# EAGLE design RoDAP (EAGLE 9.4.2)
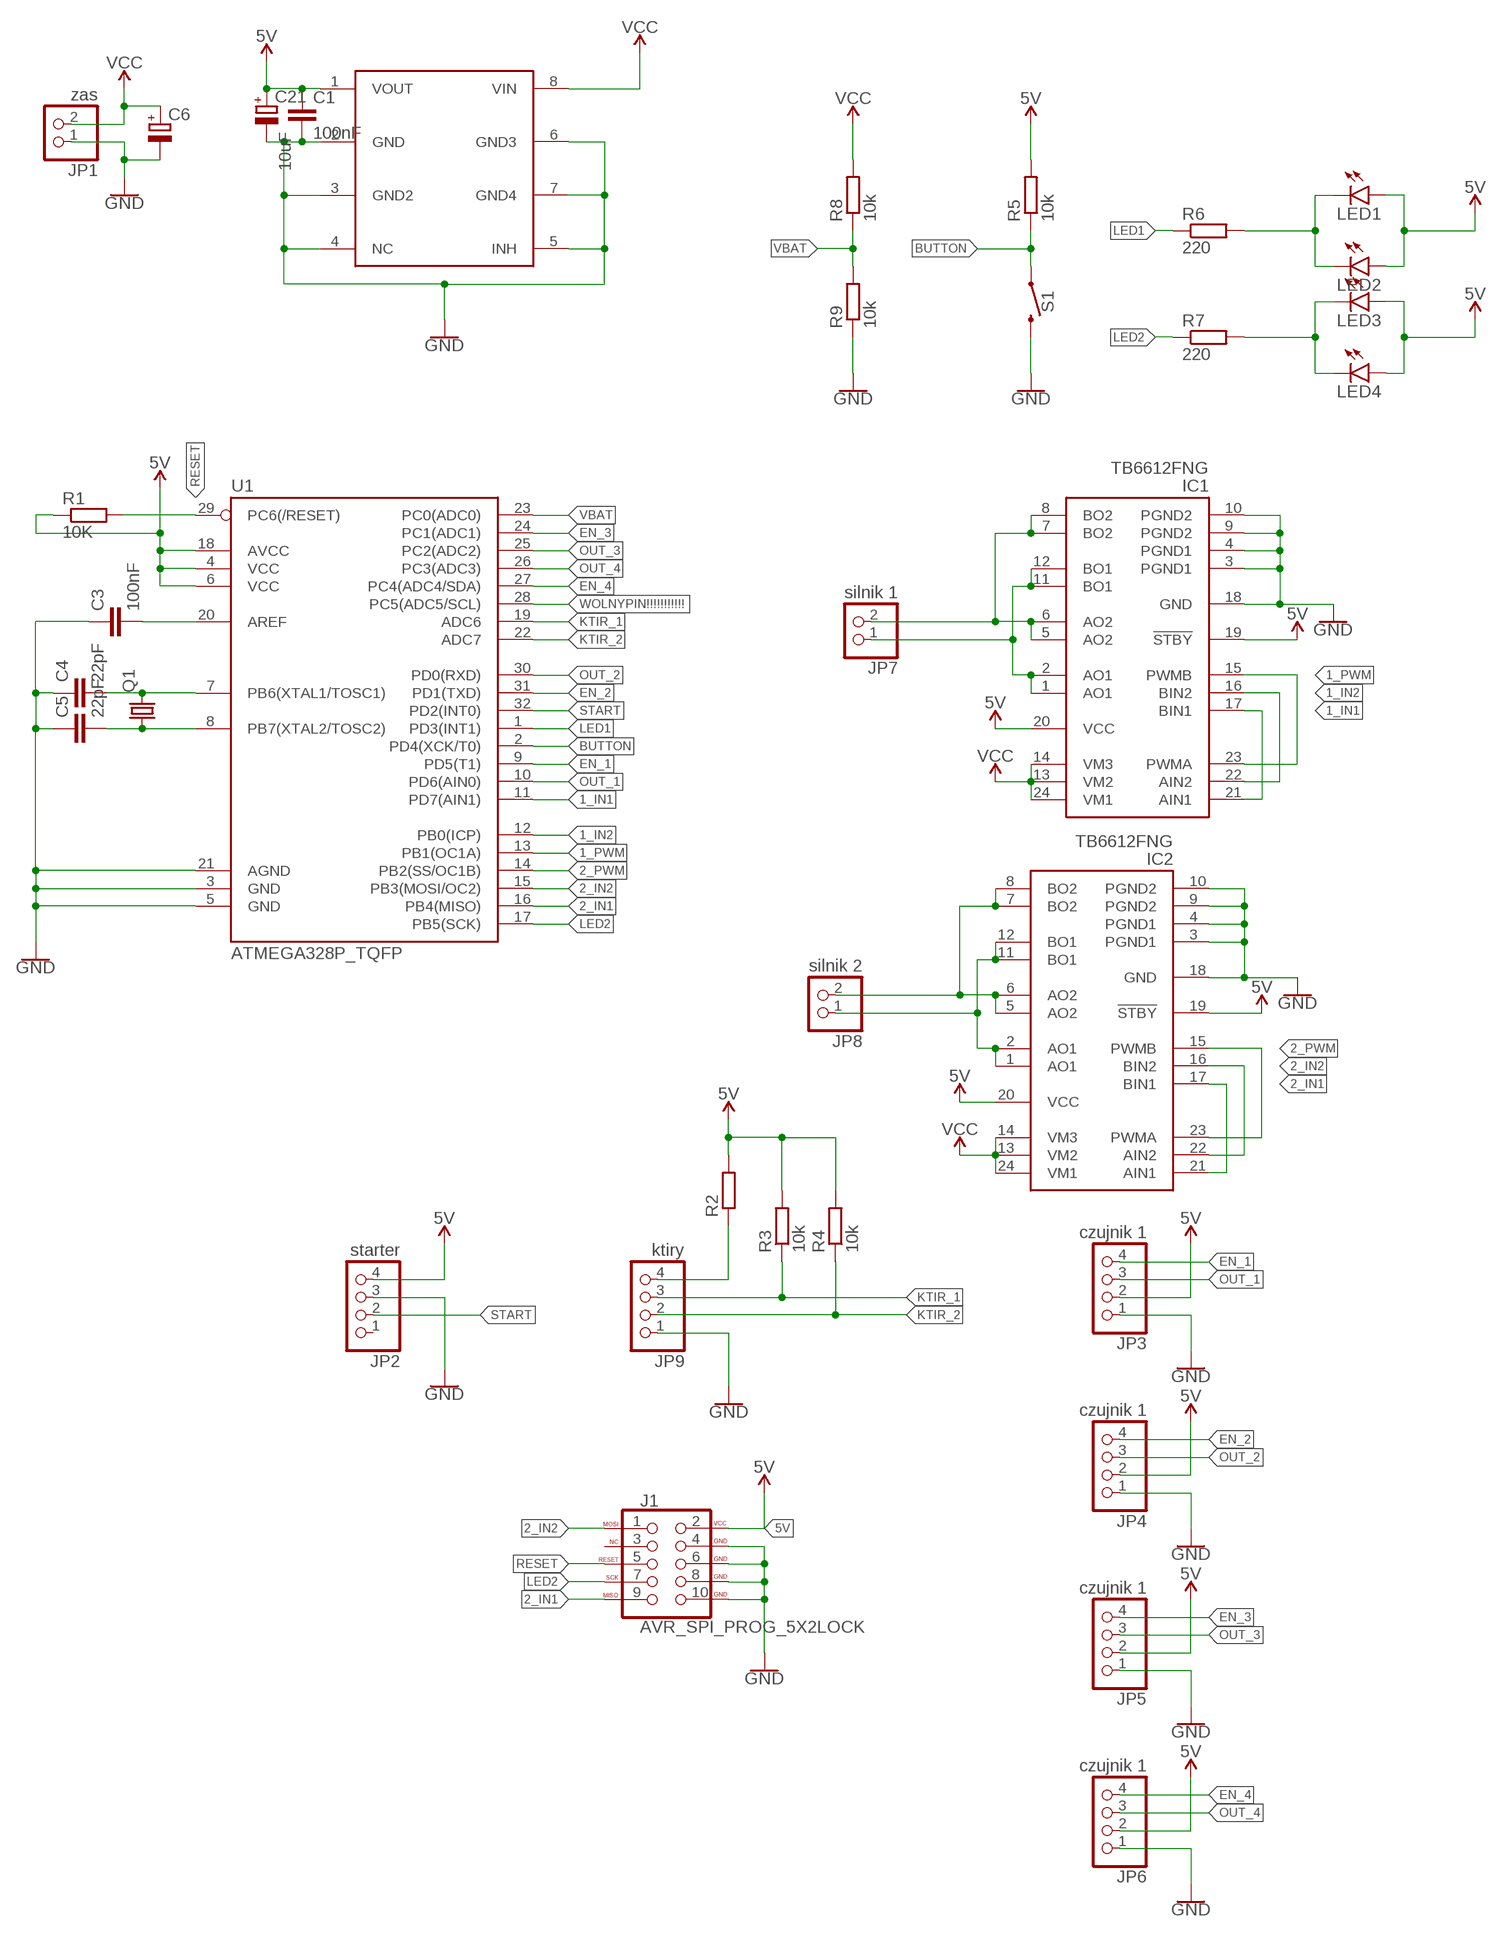
[diagram p0: schematic, sheet 1]

## Parts
C1  100nF  C-EUC0805  [C0805]
C3  100nF  C-EUC0805  [C0805]
C4  22pF  C-EUC0805  [C0805]
C5  22pF  C-EUC0805  [C0805]
C6  CPOL-EUE2.5-7  [E2,5-7]
C21  10uF  CPOL-EUSMCB  [SMC_B]
IC1  TB6612FNG  [SSOP24]
IC2  TB6612FNG  [SSOP24]
J1  AVR_SPI_PROG_5X2LOCK  [2X5-SHROUDED_LOCK]
JP1  zas  PINHD-1X2  [1X02]
JP2  starter  PINHD-1X4  [1X04]
JP3  czujnik 1  PINHD-1X4  [1X04]
JP4  czujnik 1  PINHD-1X4  [1X04]
JP5  czujnik 1  PINHD-1X4  [1X04]
JP6  czujnik 1  PINHD-1X4  [1X04]
JP7  silnik 1  PINHD-1X2  [1X02]
JP8  silnik 2  PINHD-1X2  [1X02]
JP9  ktiry  PINHD-1X4  [1X04]
LED1  LED5MM  [LED5MM]
LED2  LEDSML0805  [SML0805]
LED3  LED5MM  [LED5MM]
LED4  LEDSML0805  [SML0805]
Q1  CRYSTALHC49S  [HC49/S]
R1  10K  R-EU_R0805  [R0805]
R2  R-EU_R0805  [R0805]
R3  10k  R-EU_R0805  [R0805]
R4  10k  R-EU_R0805  [R0805]
R5  10k  R-EU_R0805  [R0805]
R6  220  R-EU_R0805  [R0805]
R7  220  R-EU_R0805  [R0805]
R8  10k  R-EU_R0805  [R0805]
R9  10k  R-EU_R0805  [R0805]
S1  MOMENTARY-SWITCH-SPST-SMD-6.0X3.5MM  [TACTILE_SWITCH_SMD_6.0X3.5MM]
U1  ATMEGA328P_TQFP  [TQFP32-08]
U$4  KF50BD-TR  [SOIC8-1.27-5X4MM]

## Nets
1_IN1: IC1.17(BIN1) IC1.21(AIN1) U1.11(PD7(AIN1))
1_IN2: IC1.16(BIN2) IC1.22(AIN2) U1.12(PB0(ICP))
1_PWM: IC1.15(PWMB) IC1.23(PWMA) U1.13(PB1(OC1A))
2_IN1: IC2.17(BIN1) IC2.21(AIN1) J1.9(MISO) U1.16(PB4(MISO))
2_IN2: IC2.16(BIN2) IC2.22(AIN2) J1.1(MOSI) U1.15(PB3(MOSI/OC2))
2_PWM: IC2.15(PWMB) IC2.23(PWMA) U1.14(PB2(SS/OC1B))
5V: C1.1 C21.+ IC1.19(!STBY) IC1.20(VCC) IC2.19(!STBY) IC2.20(VCC) J1.2(VCC) JP2.4 JP3.2 JP4.2 JP5.2 JP6.2 LED1.A LED2.A LED3.A LED4.A R1.1 R2.2 R3.2 R4.2 R5.2 U1.4(VCC) U1.6(VCC) U1.18(AVCC) U$4.1(VOUT)
BUTTON: R5.1 S1.1 U1.2(PD4(XCK/T0))
EN_1: JP3.4 U1.9(PD5(T1))
EN_2: JP4.4 U1.31(PD1(TXD))
EN_3: JP5.4 U1.24(PC1(ADC1))
EN_4: JP6.4 U1.27(PC4(ADC4/SDA))
GND: C1.2 C3.1 C4.1 C5.1 C6.- C21.- IC1.3(PGND1) IC1.4(PGND1) IC1.9(PGND2) IC1.10(PGND2) IC1.18(GND) IC2.3(PGND1) IC2.4(PGND1) IC2.9(PGND2) IC2.10(PGND2) IC2.18(GND) J1.4(GND) J1.6(GND) J1.8(GND) J1.10(GND) JP1.1 JP2.3 JP3.1 JP4.1 JP5.1 JP6.1 JP9.1 R9.1 S1.2 U1.3(GND) U1.5(GND) U1.21(AGND) U$4.2(GND) U$4.3(GND2) U$4.4(NC) U$4.5(INH) U$4.6(GND3) U$4.7(GND4)
KTIR_1: JP9.3 R3.1 U1.19(ADC6)
KTIR_2: JP9.2 R4.1 U1.22(ADC7)
LED1: R6.1 U1.1(PD3(INT1))
LED2: J1.7(SCK) R7.1 U1.17(PB5(SCK))
N$1: C3.2 U1.20(AREF)
N$2: IC2.5(AO2) IC2.6(AO2) IC2.7(BO2) IC2.8(BO2) JP8.2
N$3: C4.2 Q1.2 U1.7(PB6(XTAL1/TOSC1))
N$4: C5.2 Q1.1 U1.8(PB7(XTAL2/TOSC2))
N$5: IC2.1(AO1) IC2.2(AO1) IC2.11(BO1) IC2.12(BO1) JP8.1
N$7: JP9.4 R2.1
N$9: LED1.K(C) LED2.C R6.2
N$11: LED3.K(C) LED4.C R7.2
N$13: IC1.5(AO2) IC1.6(AO2) IC1.7(BO2) IC1.8(BO2) JP7.2
N$14: IC1.1(AO1) IC1.2(AO1) IC1.11(BO1) IC1.12(BO1) JP7.1
OUT_1: JP3.3 U1.10(PD6(AIN0))
OUT_2: JP4.3 U1.30(PD0(RXD))
OUT_3: JP5.3 U1.25(PC2(ADC2))
OUT_4: JP6.3 U1.26(PC3(ADC3))
RESET: J1.5(RESET) R1.2 U1.29(PC6(/RESET))
START: JP2.2 U1.32(PD2(INT0))
VBAT: R8.1 R9.2 U1.23(PC0(ADC0))
VCC: C6.+ IC1.13(VM2) IC1.14(VM3) IC1.24(VM1) IC2.13(VM2) IC2.14(VM3) IC2.24(VM1) JP1.2 R8.2 U$4.8(VIN)
WOLNYPIN!!!!!!!!!!!: U1.28(PC5(ADC5/SCL))
Unconnected: J1.3(NC) JP2.1

## Library data of the parts
C1 C3-C5 = resistor:C-EU: CAPACITOR, European symbol
C6 C21 = resistor:CPOL-EU: POLARIZED CAPACITOR, European symbol
IC1 IC2 = tb6612:TB6612FNG
J1 = SparkFun-Connectors:AVR_SPI_PROG_5X2: AVR 10-pin ICSP Header This is the standard AVR In Circuit Serial Programming header. Minimal, but includes pin one indicator. Works with standard Olimex programmers. SparkFun Products: 2x5 AVR ICSP Male Header <https://www.sparkfun.com/products/778> - PTH 2x5 Pin Shrouded Header <https://www.sparkfun.com/products/8506> - PTH2; PROD_ID: CONN-08671; SF_ID: PRT-08506
JP1 JP7 JP8 = pinhead:PINHD-1X2: PIN HEADER
JP2-JP6 JP9 = pinhead:PINHD-1X4: PIN HEADER
LED1-LED4 = led:LED: LED OSRAM: - CHIPLED LG R971, LG N971, LY N971, LG Q971, LY Q971, LO R971, LY R971 LH N974, LH R974 LS Q976, LO Q976, LY Q976 LO Q996 - Hyper CHIPLED LW Q18S LB Q993, LB Q99A, LB R99A - SideLED LS A670, LO A670, LY A670, LG A670, LP A670 LB A673, LV A673, LT A673, LW A673 LH A674 LY A675 LS A676, LA A676, LO A676, LY A676, LW A676 LS A679, LY A679, LG A679 - Hyper Micro SIDELED® LS Y876, LA Y876, LO Y876, LY Y876 LT Y87S - SmartLED LW L88C, LW L88S LB L89C, LB L89S, LG L890 LS L89K, LO L89K, LY L89K LS L896, LA L896, LO L896, LY L896 - TOPLED LS T670, LO T670, LY T670, LG T670, LP T670 LSG T670, LSP T670, LSY T670, LOP T670, LYG T670 LG T671, LOG T671, LSG T671 LB T673, LV T673, LT T673, LW T673 LH T674 LS T676, LA T676, LO T676, LY T676, LB T676, LH T676, LSB T676, LW T676 LB T67C, LV T67C, LT T67C, LS T67K, LO T67K, LY T67K, LW E67C LS E67B, LA E67B, LO E67B, LY E67B, LB E67C, LV E67C, LT E67C LW T67C LS T679, LY T679, LG T679 LS T770, LO T770, LY T770, LG T770, LP T770 LB T773, LV T773, LT T773, LW T773 LH T774 LS E675, LA E675, LY E675, LS T675 LS T776, LA T776, LO T776, LY T776, LB T776 LHGB T686 LT T68C, LB T68C - Hyper Mini TOPLED® LB M676 - Mini TOPLED Santana® LG M470 LS M47K, LO M47K, LY M47K Source: http://www.osram.convergy.de LUXEON: - LUMILED® LXK2-PW12-R00, LXK2-PW12-S00, LXK2-PW14-U00, LXK2-PW14-V00 LXK2-PM12-R00, LXK2-PM12-S00, LXK2-PM14-U00 LXK2-PE12-Q00, LXK2-PE12-R00, LXK2-PE12-S00, LXK2-PE14-T00, LXK2-PE14-U00 LXK2-PB12-K00, LXK2-PB12-L00, LXK2-PB12-M00, LXK2-PB14-N00, LXK2-PB14-P00, LXK2-PB14-Q00 LXK2-PR12-L00, LXK2-PR12-M00, LXK2-PR14-Q00, LXK2-PR14-R00 LXK2-PD12-Q00, LXK2-PD12-R00, LXK2-PD12-S00 LXK2-PH12-R00, LXK2-PH12-S00 LXK2-PL12-P00, LXK2-PL12-Q00, LXK2-PL12-R00 Source: www.luxeon.com KINGBRIGHT: KA-3528ASYC Source: www.kingbright.com
Q1 = crystal:CRYSTAL: CRYSTAL; OC_FARNELL: 1667008; OC_NEWARK: unknown
R1-R9 = resistor:R-EU_: RESISTOR, European symbol
S1 = SparkFun-Switches:MOMENTARY-SWITCH-SPST: Momentary Switch (Pushbutton) - SPST Normally-open (NO) SPST momentary switches (buttons, pushbuttons). Variants PTH-12MM - 12mm square, through-hole Momentary Pushbutton Switch - 12mm Square <https://www.sparkfun.com/products/9190> (COM-09190) PTH-6.0MM, PTH-6.0MM-KIT - 6.0mm square, through-hole Mini Pushbutton Switch <https://www.sparkfun.com/products/97> (COM-00097) KIT package intended for soldering kit's - only one side of pads' copper is exposed. PTH-RIGHT-ANGLE-KIT - Right-angle, through-hole Right Angle Tactile Button <https://www.sparkfun.com/products/10791> - Used on SparkFun BigTime Watch Kit <https://www.sparkfun.com/products/11734> SMD-12MM - 12mm square, surface-mount Tactile Button - SMD (12mm) <https://www.sparkfun.com/products/12993> (COM-12993) Used on SparkFun PicoBoard <https://www.sparkfun.com/products/11888> SMD-4.5MM - 4.5mm Square Trackball Switch Used on SparkFun Blackberry Trackballer Breakout <https://www.sparkfun.com/products/13169> SMD-4.6MMX2.8MM - 4.60mm x 2.80mm, surface mount Used on SparkFun SAMD21 Mini Breakout <https://www.sparkfun.com/products/13664> SMD-5.2MM, SMD-5.2-REDUNDANT - 5.2mm square, surface-mount Mini Pushbutton Switch - SMD <https://www.sparkfun.com/products/8720> (COM-08720) Used on Arduino Pro Mini <https://www.sparkfun.com/products/11114> REDUNDANT package connects both switch circuits together SMD-6.0X3.5MM - 6.0 x 3.5mm, surface mount Momentary Reset Switch SMD <https://www.sparkfun.com/products/8229> (COM-08229) SMD-6.2MM-TALL - 6.2mm square, surface mount Tactile Button - SMD (6mm) <https://www.sparkfun.com/products/12992> Used on SparkFun Digital Sandbox <https://www.sparkfun.com/products/12651> SMD-RIGHT-ANGLE - Right-angle, surface mount Used on SparkFun Block for Intel® Edison - Arduino <https://www.sparkfun.com/products/13036>; PROD_ID: SWCH-00815; SF_SKU: COM-08229
U1 = SparkFun-IC-Microcontroller:ATMEGA328P_TQFP: Popular 328P in QFP Storefront component: ATmega328 - TQFP <https://www.sparkfun.com/products/13448> (COM-13448) Datasheet <http://www.sparkfun.com/datasheets/Components/SMD/ATMega328.pdf> SparkFun Products SparkFun RedBoard - Programmed with Arduino <https://www.sparkfun.com/products/12757> (DEV-12757) Arduino Pro Mini 328 - 5V/16MHz <https://www.sparkfun.com/products/11113> (DEV-11113) Arduino Pro Mini 328 - 3.3V/8MHz <https://www.sparkfun.com/products/11114> (DEV-11114) SparkFun OpenLog <https://www.sparkfun.com/products/13712> (DEV-13712) SparkFun MicroView - OLED Arduino Module <https://www.sparkfun.com/products/12923> (DEV-12923) SparkFun Digital Sandbox <https://www.sparkfun.com/products/12651> (DEV-12651) SparkFun PicoBoard <https://www.sparkfun.com/products/11888> (WIG-11888) Arduino Fio <https://www.sparkfun.com/products/10116> (DEV-10116) LilyPad Arduino 328 Main Board <https://www.sparkfun.com/products/13342> (DEV-13342) SparkFun RedStick <https://www.sparkfun.com/products/13741> (DEV-13741) LilyPad MP3 <https://www.sparkfun.com/products/11013> (DEV-11013) LilyPad Arduino SimpleSnap <https://www.sparkfun.com/products/10941> (DEV-10941) SparkFun Stepoko <https://www.sparkfun.com/products/13899> (ROB-13899) SparkFun Geiger Counter <https://www.sparkfun.com/products/11345> (SEN-11345) SparkFun EL Sequencer <https://www.sparkfun.com/products/12781> (COM-12781) Arduino Pro 328 - 5V/16MHz <https://www.sparkfun.com/products/10915> (DEV-10915) CryptoCape <https://www.sparkfun.com/products/12773> (DEV-12773) SparkFun IR Thermometer Evaluation Board - MLX90614 <https://www.sparkfun.com/products/10740> (SEN-10740) SparkFun RedBot Mainboard <https://www.sparkfun.com/products/12097> (ROB-12097) Arduino Pro 328 - 3.3V/8MHz <https://www.sparkfun.com/products/10914> (DEV-10914) SparkFun Block for Intel® Edison - Arduino <https://www.sparkfun.com/products/13036> (DEV-13036) SparkFun Simon Says - Surface Mount Soldering Kit <https://www.sparkfun.com/products/10935> (KIT-10935) SparkFun 7-Segment Serial Display - Red <https://www.sparkfun.com/products/11441> (COM-11441) SparkFun 7-Segment Serial Display - White <https://www.sparkfun.com/products/11629> (COM-11629) SparkFun 7-Segment Serial Display - Yellow <https://www.sparkfun.com/products/11443> (COM-11443) SparkFun 7-Segment Serial Display - Kelly Green <https://www.sparkfun.com/products/11440> (COM-11440) SparkFun 7-Segment Serial Display - Blue <https://www.sparkfun.com/products/11442> (COM-11442) SparkFun OpenSegment Serial Display - 20mm (Blue) <https://www.sparkfun.com/products/11647> (COM-11647) SparkFun OpenSegment Serial Display - 20mm (Green) <https://www.sparkfun.com/products/11646> (COM-11646) SparkFun OpenSegment Serial Display - 20mm (White) <https://www.sparkfun.com/products/11648> (COM-11648) SparkFun OpenSegment Serial Display - 20mm (Red) <https://www.sparkfun.com/products/11644> (COM-11644) SparkFun OpenSegment Serial Display - 20mm (Yellow) <https://www.sparkfun.com/products/11645> (COM-11645) SparkFun OpenSegment Shield <https://www.sparkfun.com/products/13190> (DEV-13190); PROD_ID: IC-09069
U$4 = kb50chyba:KF50BD-TR

## Board
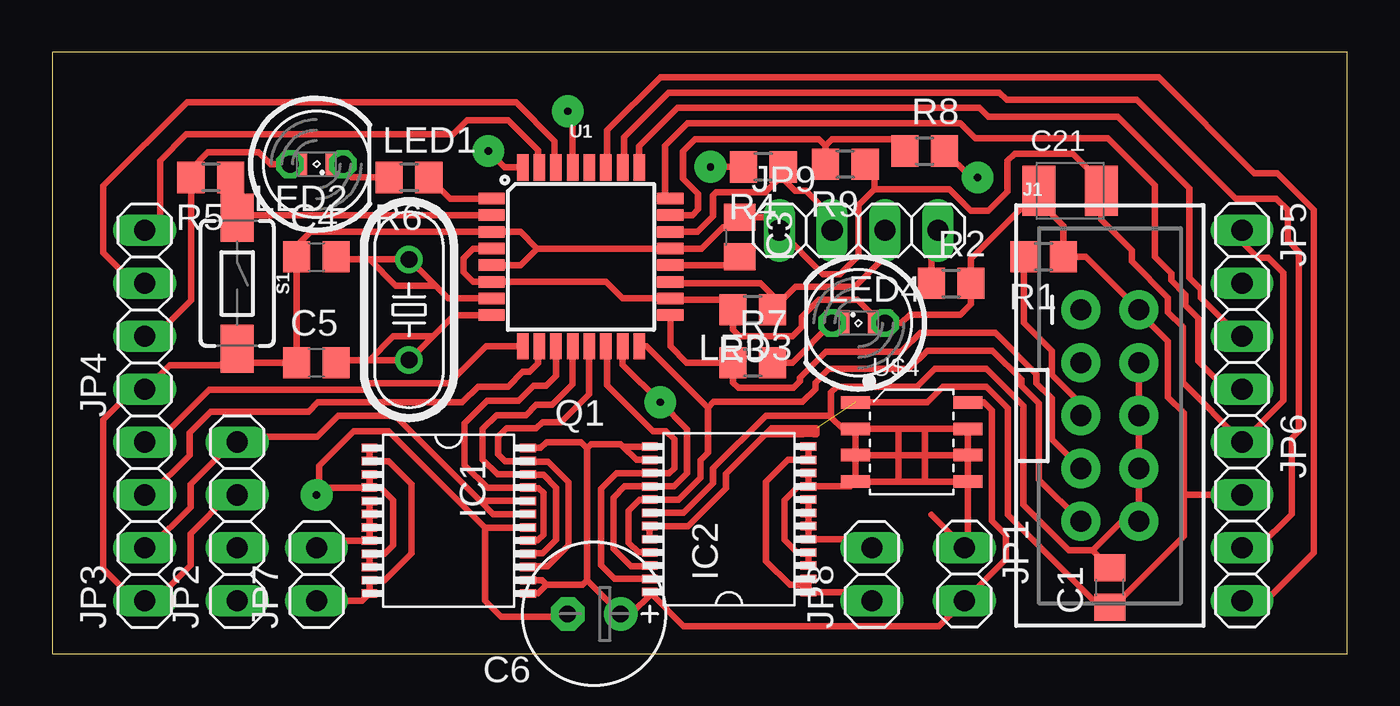
[diagram p1: board, top side]
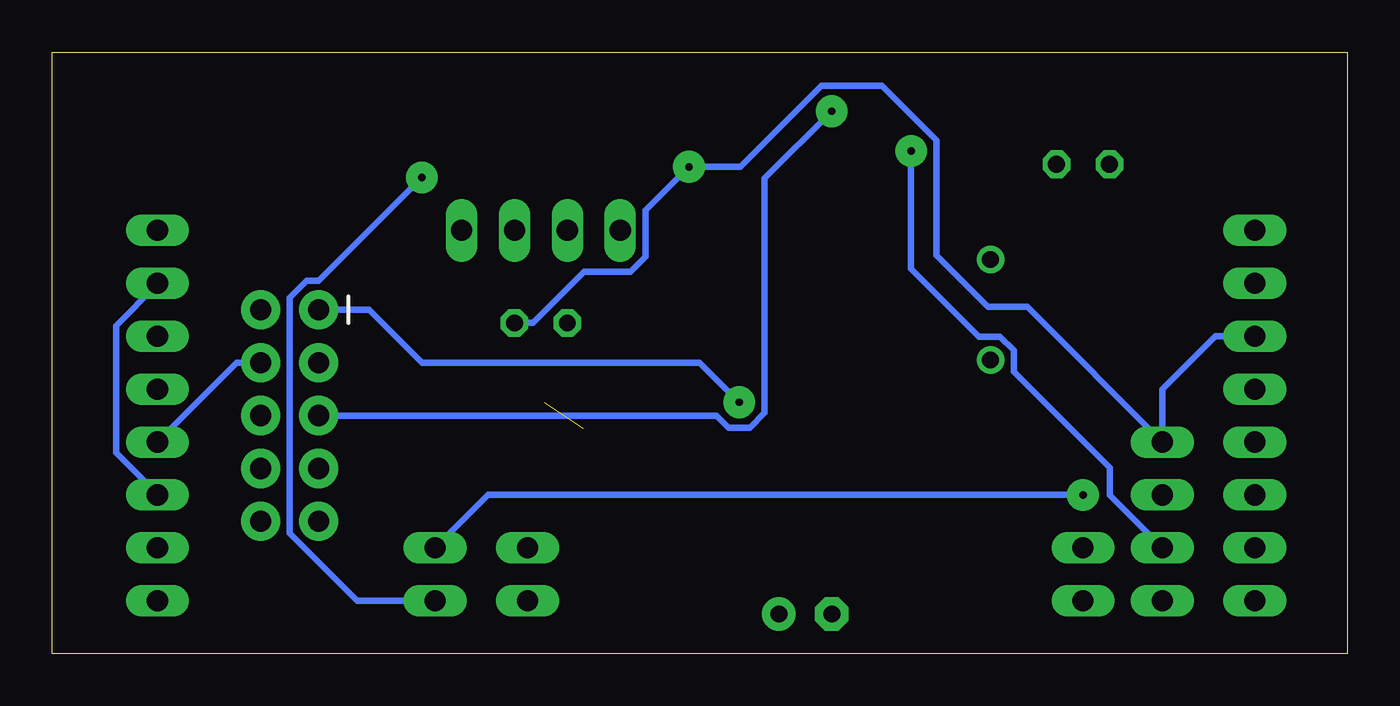
[diagram p2: board, bottom side, seen from below]

Size 62.21 x 28.88 mm. Coordinates in mm from the lower left corner, seen from the top.
Outline: 0,0 62.21,0 62.21,28.88 0,28.88 0,0
Copper layers (1*16): Top 0.035mm / dielectric 1.5mm / Bottom 0.035mm
Design rules "default *": minimum track width 12mil, minimum drill 0.35mm, track to track 12mil, track to pad 1mil, pad to pad 1mil, via to via 12mil, smd to smd 0mil, copper to edge 40mil, drill to drill 6mil, minimum pad ring 10mil, minimum via ring 8mil, stop-mask expansion 4mil, vias tented up to drill 0mil, thermal gap 10mil

### Footprints (pad centres in the part's own frame; a part is rotated, then mirrored left to right if it is on the bottom)
C0805 = smd 1.3 x 1.5: 1 -0.95,0; 2 0.95,0
E2,5-7 = drill 0.813 pad 1.6: + -1.27,0 | drill 0.813 pad 1.6 octagon: - 1.27,0
SMC_B = smd 1.6 x 2.4: + -1.5,0; - 1.5,0
SSOP24 = smd 0.406 x 0.762: 1 -3.651,-3.81; 2 -3.016,-3.81; 3 -2.381,-3.81; 4 -1.746,-3.81; 5 -1.111,-3.81; 6 -0.476,-3.81; 7 0.159,-3.81; 8 0.794,-3.81; 9 1.429,-3.81; 10 2.064,-3.81; 11 2.699,-3.81; 12 3.334,-3.81; 13 3.334,3.81; 14 2.699,3.81; 15 2.064,3.81; 16 1.429,3.81; 17 0.794,3.81; 18 0.159,3.81; 19 -0.476,3.81; 20 -1.111,3.81; 21 -1.746,3.81; 22 -2.381,3.81; 23 -3.016,3.81; 24 -3.651,3.81
2X5-SHROUDED_LOCK = drill 1.016 pad 1.88: 1 -1.397,5.08; 2 1.397,5.08; 3 -1.397,2.54; 4 1.397,2.54; 5 -1.397,0; 6 1.397,0; 7 -1.397,-2.54; 8 1.397,-2.54; 9 -1.397,-5.08; 10 1.397,-5.08
1X02 = drill 1.016 long: 1 -1.27,0; 2 1.27,0
1X04 = drill 1.016 long: 1 -3.81,0; 2 -1.27,0; 3 1.27,0; 4 3.81,0
LED5MM = drill 0.813 octagon: A -1.27,0; K 1.27,0
SML0805 = smd 1.2 x 1.2: A 1.05,0; C -1.05,0
HC49/S = drill 0.813: 1 -2.413,0; 2 2.413,0
R0805 = smd 1.3 x 1.5: 1 -0.95,0; 2 0.95,0
TACTILE_SWITCH_SMD_6.0X3.5MM = smd 2.3 x 1.6: 1 -3.15,0; 2 3.15,0
TQFP32-08 = smd 1.27 x 0.559: 1 -4.293,2.8; 2 -4.293,2; 3 -4.293,1.2; 4 -4.293,0.4; 5 -4.293,-0.4; 6 -4.293,-1.2; 7 -4.293,-2; 8 -4.293,-2.8; 17 4.293,-2.8; 18 4.293,-2; 19 4.293,-1.2; 20 4.293,-0.4; 21 4.293,0.4; 22 4.293,1.2; 23 4.293,2; 24 4.293,2.8 | smd 0.559 x 1.27: 9 -2.8,-4.293; 10 -2,-4.293; 11 -1.2,-4.293; 12 -0.4,-4.293; 13 0.4,-4.293; 14 1.2,-4.293; 15 2,-4.293; 16 2.8,-4.293; 25 2.8,4.293; 26 2,4.293; 27 1.2,4.293; 28 0.4,4.293; 29 -0.4,4.293; 30 -1.2,4.293; 31 -2,4.293; 32 -2.8,4.293
SOIC8-1.27-5X4MM = smd 0.6 x 1.4: 1 -1.905,-2.7; 2 -0.635,-2.7; 3 0.635,-2.7; 4 1.905,-2.7; 5 1.905,2.7; 6 0.635,2.7; 7 -0.635,2.7; 8 -1.905,2.7

### Placement (x,y rotation side)
C1  50.8,3.17 90 top
C3  33.02,20 270 top
C4  12.7,19.05 0 top
C5  12.7,13.97 0 top
C6  26.04,1.9 180 top
C21  48.89,22.22 0 top
IC1  19.05,6.22 270 top
IC2  32.51,6.6 90 top
J1  50.8,11.43 0 top
JP1  43.81,3.81 270 top
JP2  8.89,6.35 90 top
JP3  4.45,6.35 90 top
JP4  4.45,16.51 90 top
JP5  57.15,16.51 270 top
JP6  57.15,6.35 270 top
JP7  12.7,3.81 90 top
JP8  39.37,3.81 90 top
JP9  38.73,20.32 0 top
LED1  12.7,23.49 0 top
LED2  12.7,23.49 180 top
LED3  38.73,15.88 180 top
LED4  38.73,15.88 0 top
Q1  17.14,16.51 90 top
R1  47.62,19.05 180 top
R2  43.18,17.78 0 top
R3  33.66,16.51 180 top
R4  34.16,23.37 180 top
R5  7.62,22.86 180 top
R6  17.14,22.86 180 top
R7  33.66,13.97 0 top
R8  41.91,24.13 0 top
R9  38.1,23.49 180 top
S1  8.89,17.78 270 top
U1  25.4,19.05 0 top
U$4  41.27,10.16 270 top

### Tracks (layer width: path | path; a pad name or v marks a point on that pad's centre or on a via)
1_IN1
  Top 0.305: U1.11 24.2,13.35 23.71,12.86 23.13,12.86 22.41,12.14 20.9,12.14 19.82,11.06 19.82,9.06 20.91,7.97 IC1.21 22.89,7.94 23.37,7.94 23.6,7.71 23.6,5.71 23.32,5.43 IC1.17
1_IN2
  Top 0.305: U1.12 25,12.93 24,11.94 23.24,11.94 22.76,11.45 21.35,11.45 20.69,10.79 20.69,9.31 21.39,8.6 IC1.22 22.89,8.58 23.59,8.58 24.21,7.97 24.21,5.46 23.57,4.82 22.89,4.82 IC1.16
1_PWM
  Top 0.305: U1.13 25.8,12.46 24.46,11.12 23.55,11.12 23.24,10.81 21.82,10.81 21.42,10.41 21.42,9.56 21.75,9.24 IC1.23 22.89,9.21 23.82,9.21 24.82,8.22 24.82,5.21 23.79,4.18 22.89,4.18 IC1.15
2_IN1
  Top 0.305: 30.1,7.4 31.14,8.44 31.14,9.3 31.5,9.65 31.5,11.81 | J1.9 47.4,8.36 47.4,12.01 46.54,12.87 46.54,13.17 45.17,14.55 42.03,14.55 41.15,13.67 37.32,13.67 36.65,13 36.65,12.7 36.04,12.09 31.78,12.09 31.5,11.81 | U1.16 28.55,14.76 31.5,11.81 | IC2.17 30.1,7.4 | IC2.21 28.16,4.86 27.69,5.33 27.69,6.86 28.21,7.38 28.57,7.38 28.7,7.38 30.08,7.38 30.1,7.4
2_IN2  (via drill 0.35 pad 1.53)
  Top 0.305: U1.15 27.4,13.88 v29.21,12.06 30.49,10.78 30.49,8.66 29.87,8.03 IC2.16 27.5,8.03 26.96,7.49 26.96,5.04 27.81,4.2 28.68,4.2 IC2.22
  Bottom 0.305: v29.21,12.06 31.11,13.97 44.45,13.97 46.99,16.51 J1.1
2_PWM
  Top 0.305: U1.14 26.66,14.69 26.66,12.88 28.86,10.69 29.49,10.69 29.89,10.29 29.89,8.91 29.64,8.67 IC2.15 27.1,8.67 26.35,7.92 26.35,4.25 27.02,3.59 IC2.23
5V  (via drill 0.35 pad 1.53)  (1 unrouted)
  Top 0.305: U1.4 20.22,19.45 19.76,18.99 19.76,18.31 20.22,17.85 U1.6 26.6,17.85 27.4,17.05 U1.18 29.76,16.99 32.23,16.99 R3.2 32.7,15.55 33.02,15.24 35.56,15.24 36.02,15.7 36.02,16.18 36.83,16.99 38.67,16.99 LED4.A | JP3.2 4.7,5.08 6.65,7.04 6.65,8.12 8.51,9.98 8.89,9.98 JP2.4 9.14,10.41 12.73,10.41 13.73,11.42 16.47,11.42 20.56,7.33 | JP4.2 4.95,15.24 6.67,16.96 R5.2 6.67,23.26 7.48,24.07 9.92,24.07 10.49,23.49 LED1.A LED2.A | R1.1 48.59,19.04 | 46.99,21.82 C21.+ | LED4.A 40.8,15.88 41.2,16.28 43.62,16.28 44.13,16.79 R2.2 44.13,18.96 C21.+ | R4.2 v31.62,23.37 | LED4.A LED3.A | U$4.1 42.04,12.06 42.79,12.82 44.86,12.82 45.91,11.78 45.91,6.67 50.35,2.22 C1.1 50.95,2.22 54.36,5.63 54.36,7.62 | R1.1 49.66,19.05 J1.2 52.2,16.38 53.59,14.99 53.59,12.32 54.36,11.56 54.36,7.62 | C21.+ 47.39,21.72 48.57,20.54 R1.1 | JP6.2 54.36,7.62 | IC1.20 20.56,7.33 | IC1.19 21.19,6.7 20.56,7.33 | IC2.20 IC2.19 30.55,6.13 32.36,7.94 32.36,8.64 34.54,10.82 36.7,10.82 36.7,10.54 36.58,10.54 36.57,10.55 36.07,10.55 36.06,10.54 34.29,10.54
  Bottom 0.305: JP5.2 57.15,17.73 59.13,15.75 59.13,9.66 57.15,7.67 JP6.2 | LED3.A 39.12,15.88 36.65,18.34 34.42,18.34 33.71,19.05 33.71,21.29 v31.62,23.37 29.16,23.37 25.27,27.26 22.35,27.26 19.73,24.64 19.73,19.13 17.26,16.65 15.38,16.65 JP2.4 8.89,12.7 6.35,15.24 JP4.2
BUTTON
  Top 0.305: R5.1 8.57,21.25 S1.1 9.01,21.05 U1.2
EN_1
  Top 0.305: JP3.4 5.03,10.16 7.55,12.68 14.96,12.68 15.26,12.98 19.08,12.98 20.85,14.76 U1.9
EN_2
  Top 0.305: JP4.4 5.18,21.06 5.18,23.67 6.44,24.93 19.27,24.93 19.94,25.6 21.9,25.6 23.34,24.17 23.34,23.41 U1.31
EN_3
  Top 0.305: JP5.4 56.39,12.7 55.04,14.05 55.04,16.11 54.43,16.71 54.43,17.24 53.74,17.93 53.74,18.27 52.96,19.05 52.96,22.48 50.7,24.74 44.35,24.74 43.62,25.46 30.51,25.46 29.44,24.39 29.44,22.1 U1.24
EN_4
  Top 0.305: U1.27 26.66,23.41 26.66,25.12 29.22,27.67 53.14,27.67 57.74,23.07 58.84,23.07 60.6,21.31 60.6,4.85 58.29,2.54 JP6.4
GND  (via drill 0.35 pad 1.53)
  Top 0.305: U1.5 22.5,18.65 23.3,19.45 | 23.3,19.45 U1.21 31.2,19.45 32.23,20.48 32.54,20.48 C3.1 34.29,20.95 JP9.1 37.03,18.21 37.84,18.21 38.73,19.1 38.73,21.54 39.5,22.3 | 23.3,19.45 22.5,20.25 U1.3 15.51,20.25 15.51,20.26 12.43,20.26 11.78,19.61 11.78,19.34 11.75,19.3 C4.1 C5.1 9.55,13.97 S1.2 8.1,13.84 5.64,13.84 4.79,12.99 4.74,12.99 JP4.1 3.94,12.7 2.46,11.23 2.46,4.07 3.99,2.54 JP3.1 4.95,2.54 6.65,4.24 6.65,5.77 8.51,7.62 JP2.3 | 12.99,7.32 v12.7,7.62 | 42.22,6.67 JP1.1 43.97,5.24 U$4.5 | U$4.3 U$4.4 | U$4.4 40.64,8.25 | 40.64,8.25 41.91,8.25 | 41.91,8.25 U$4.5 | U$4.5 U$4.6 | 20.79,6.04 16.16,10.68 14.49,10.68 12.83,9.02 12.83,7.75 v12.7,7.62 | 20.79,6.04 22.23,6.04 22.69,6.04 22.84,6.04 IC1.18 | 20.79,6.04 20.79,2.54 21.56,1.76 24.62,1.76 C6.- | U$4.3 U$4.2 | U$4.6 U$4.7 41.91,10.79 | 49.98,4.95 48.82,4.95 46.64,7.14 46.64,11.91 44.86,13.69 42.39,13.69 41.53,12.82 37.69,12.82 37.42,12.55 37.42,11.35 | 49.98,4.95 51.38,6.35 J1.10 J1.8 J1.6 J1.4 | 39.5,22.3 43.1,22.3 44.13,21.27 44.97,21.27 45.89,22.19 45.89,23.66 46.23,24 49.02,24 50.39,22.63 C21.- 50.39,20.83 51.85,19.37 51.85,18.83 53.59,17.09 53.59,16.38 54.29,15.68 54.29,13.02 JP6.1 59.13,12.14 59.13,18.29 58.42,19 57.91,19 57.15,19.76 JP5.1 | C1.2 49.98,4.94 49.98,4.95 | R9.1 39.5,23.04 39.5,22.3 | U$4.2 37.97,10.79 37.42,11.35 | 37.42,11.35 37.34,11.43 34.29,11.43 31.75,8.89 31.75,8.19 30.32,6.76 IC2.18 | U$4.2 40.64,10.79 | 40.64,10.79 41.91,10.79 | U$4.3 U$4.6 | 41.91,10.79 41.91,8.25 | 40.64,10.79 40.64,8.25 | IC1.3 IC1.4 | IC1.10 IC1.9 15.97,4.79 16.38,5.21 16.38,7.37 15.78,7.97 IC1.4 | IC1.4 13.05,7.97 v12.7,7.62
  Top 0.305: IC2.10 IC2.9 | IC2.3 IC2.4 35.78,4.86 35.18,5.46 35.18,7.37 35.85,8.03 IC2.9 | IC2.9 38.35,8.03 U$4.4
  Bottom 0.305: v12.7,7.62 41.27,7.62 JP1.1 | JP6.1 53.34,13.97 J1.4
KTIR_1
  Top 0.305: JP9.3 40,19.05 38.56,17.6 35.7,17.6 R3.1 34.6,17.21 34.03,17.79 29.76,17.79 U1.19
KTIR_2
  Top 0.305: U1.22 30.99,20.25 31.74,21 31.74,22.01 31.88,22.15 34.27,22.15 35.11,22.99 R4.1 35.11,22.8 35.69,22.22 36.2,22.22 37.46,20.95 JP9.2
LED1
  Top 0.305: U1.1 19.11,21.85 R6.1
LED2
  Top 0.305: J1.7 48.01,10.29 48.01,12.27 47.28,12.99 47.28,13.43 45.29,15.41 41.7,15.41 40.77,14.48 37.16,14.48 35.91,13.23 35.91,13.08 35.6,12.76 32.96,12.76 32.7,13.02 R7.1 30.48,13.97 29.69,14.76 U1.17
N$1
  Top 0.305: U1.20 32.62,18.65 C3.2
N$2
  Top 0.305: IC2.8 IC2.7 IC2.6 IC2.5 38.96,5.49 JP8.2
N$3
  Top 0.305: U1.7 19.02,17.05 18.42,17.65 | 18.42,17.65 Q1.2 15.24,18.92 | 15.24,18.92 13.78,18.92 C4.2 | 15.24,18.92 16.51,17.65 18.42,17.65
N$4
  Top 0.305: U1.8 19.3,16.25 18.29,15.24 | 18.29,15.24 Q1.1 15.24,14.1 | 15.24,14.1 13.78,14.1 C5.2 | 15.24,14.1 16.38,15.24 18.29,15.24
N$5
  Top 0.305: IC2.12 IC2.11 35.34,9.3 34.29,8.25 34.29,4.45 35.43,3.3 36.32,3.3 | 36.32,3.3 IC2.1 38.96,2.95 JP8.1 | 36.32,3.3 IC2.2
N$7
  Top 0.305: R2.1 42.23,20 JP9.4
N$9
  Top 0.305: LED1.K LED2.C 14.38,22.86 R6.2
N$11
  Top 0.305: R7.2 35.56,13.97 LED3.K LED4.C
N$13
  Top 0.305: IC1.5 IC1.6 IC1.7 IC1.8 13.05,5.43 JP7.2
N$14
  Top 0.305: IC1.1 IC1.2 16.16,9.24 17.27,8.13 17.27,4.83 15.97,3.52 IC1.11 IC1.12 14.89,2.54 JP7.1
OUT_1
  Top 0.305: U1.10 23.34,14.69 23.34,13.93 22.93,13.52 22.61,13.52 21.91,12.82 20.45,12.82 19.69,12.06 12.76,12.06 12.32,11.62 7.61,11.62 6.6,10.61 6.6,9.52 4.7,7.62 JP3.3
OUT_2
  Top 0.305: JP4.3 3.94,17.78 2.46,19.25 2.46,22.45 6.48,26.47 22.28,26.47 24.14,24.61 24.14,23.41 U1.30
OUT_3
  Top 0.305: JP5.3 57.02,15.24 55.17,17.09 55.17,17.49 54.62,18.04 54.62,22.34 51.18,25.78 44.96,25.78 44.54,26.2 30.04,26.2 28.2,24.36 U1.25
OUT_4
  Top 0.305: U1.26 27.46,23.41 27.46,24.8 29.6,26.94 45.5,26.94 45.85,26.59 52.1,26.59 56.84,21.84 58.8,21.84 59.33,21.31 59.33,19.84 59.87,19.3 59.87,10.67 59.54,10.34 59.54,6.7 57.91,5.08 JP6.3
RESET  (via drill 0.35 pad 1.53)
  Top 0.305: U1.29 25,25.8 v24.77,26.03 | J1.5 49.4,11.99 48.01,13.39 48.01,14.54 46.67,15.88 R1.2
  Bottom 0.305: v24.77,26.03 27.99,22.81 27.99,11.56 28.7,10.84 29.72,10.84 30.3,11.43 J1.5
START  (via drill 0.35 pad 1.53)
  Top 0.305: v20.96,24.13 21.74,23.34 U1.32
  Bottom 0.305: v20.96,24.13 20.96,18.47 17.7,15.21 16.68,15.21 16.03,14.56 16.03,13.54 11.4,8.92 11.4,7.59 JP2.2
VBAT
  Top 0.305: 37.15,24.39 37.46,24.7 40.39,24.7 R8.1 | 37.15,24.39 R9.2 | 37.15,24.39 36.84,24.7 30.87,24.7 30.3,24.13 30.3,22.8 31.03,22.07 31.03,21.34 30.75,21.05 U1.23
VCC  (via drill 0.35 pad 1.53)
  Top 0.305: R8.2 44.13,22.86 v44.45,22.86 | U$4.8 44.76,12.06 45.13,11.69 45.13,6.38 45.8,5.71 45.8,4.52 JP1.2 42.6,1.32 30.33,1.32 28.78,2.87 | 25.69,9.87 25.4,10.16 23.75,10.16 23.46,9.87 IC1.24 | C6.+ 27.86,1.9 | C6.+ 25.69,3.52 | 25.69,3.52 25.69,9.87 | 23.75,3.3 25.47,3.3 25.69,3.52 | IC1.14 23.53,3.52 23.75,3.3 | IC1.13 23.34,2.89 23.75,3.3 | IC2.13 27.94,9.94 27.43,9.94 | 25.69,9.87 25.89,10.06 27.3,10.06 27.43,9.94 | IC2.14 28.07,9.3 27.43,9.94 | 28.78,2.87 IC2.24 | C6.+ 27.81,1.9 28.78,2.87
  Bottom 0.305: v44.45,22.86 49.4,17.91 49.98,17.91 50.8,17.09 50.8,5.77 47.57,2.54 JP1.2